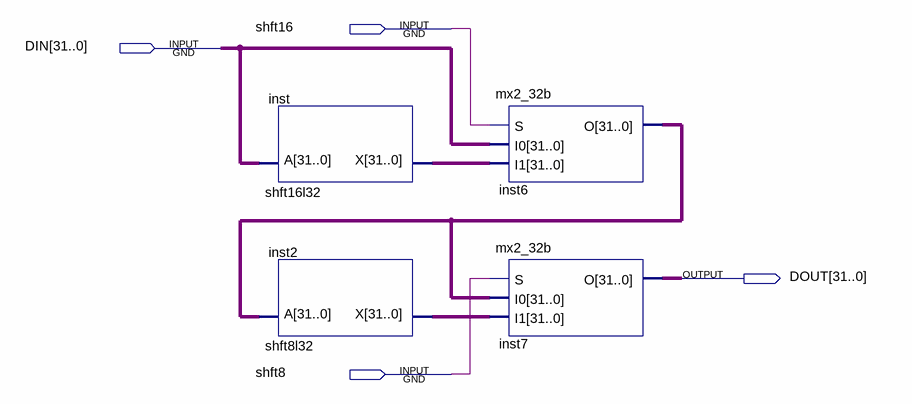
[diagram p0: schematic sheet]
// Quartus schematic sram_input_shift.bdf as structural Verilog: 4 symbols, 4 pins
module sram_input_shift (
  input  shft16,
  input  [31:0] DIN,
  input  shft8,
  output [31:0] DOUT
);

  wire [31:0] inst2_x, inst6_o, inst_x;

  shft16l32 inst (.A(DIN), .X(inst_x));
  shft8l32 inst2 (.A(inst6_o), .X(inst2_x));
  mx2_32b inst6 (.S(shft16), .I0(DIN), .I1(inst_x), .O(inst6_o));
  mx2_32b inst7 (.S(shft8), .I0(inst6_o), .I1(inst2_x), .O(DOUT));
endmodule
